# Altium schematic sheet USB2.0 Host Connectors.SchDoc: RK3399 COB Design V1.0
size A4; Author: AVIRAL MISHRA; DocumentNumber: 21; SheetNumber: 21; SheetTotal: 27; PROJECT CODE: A_V1.0
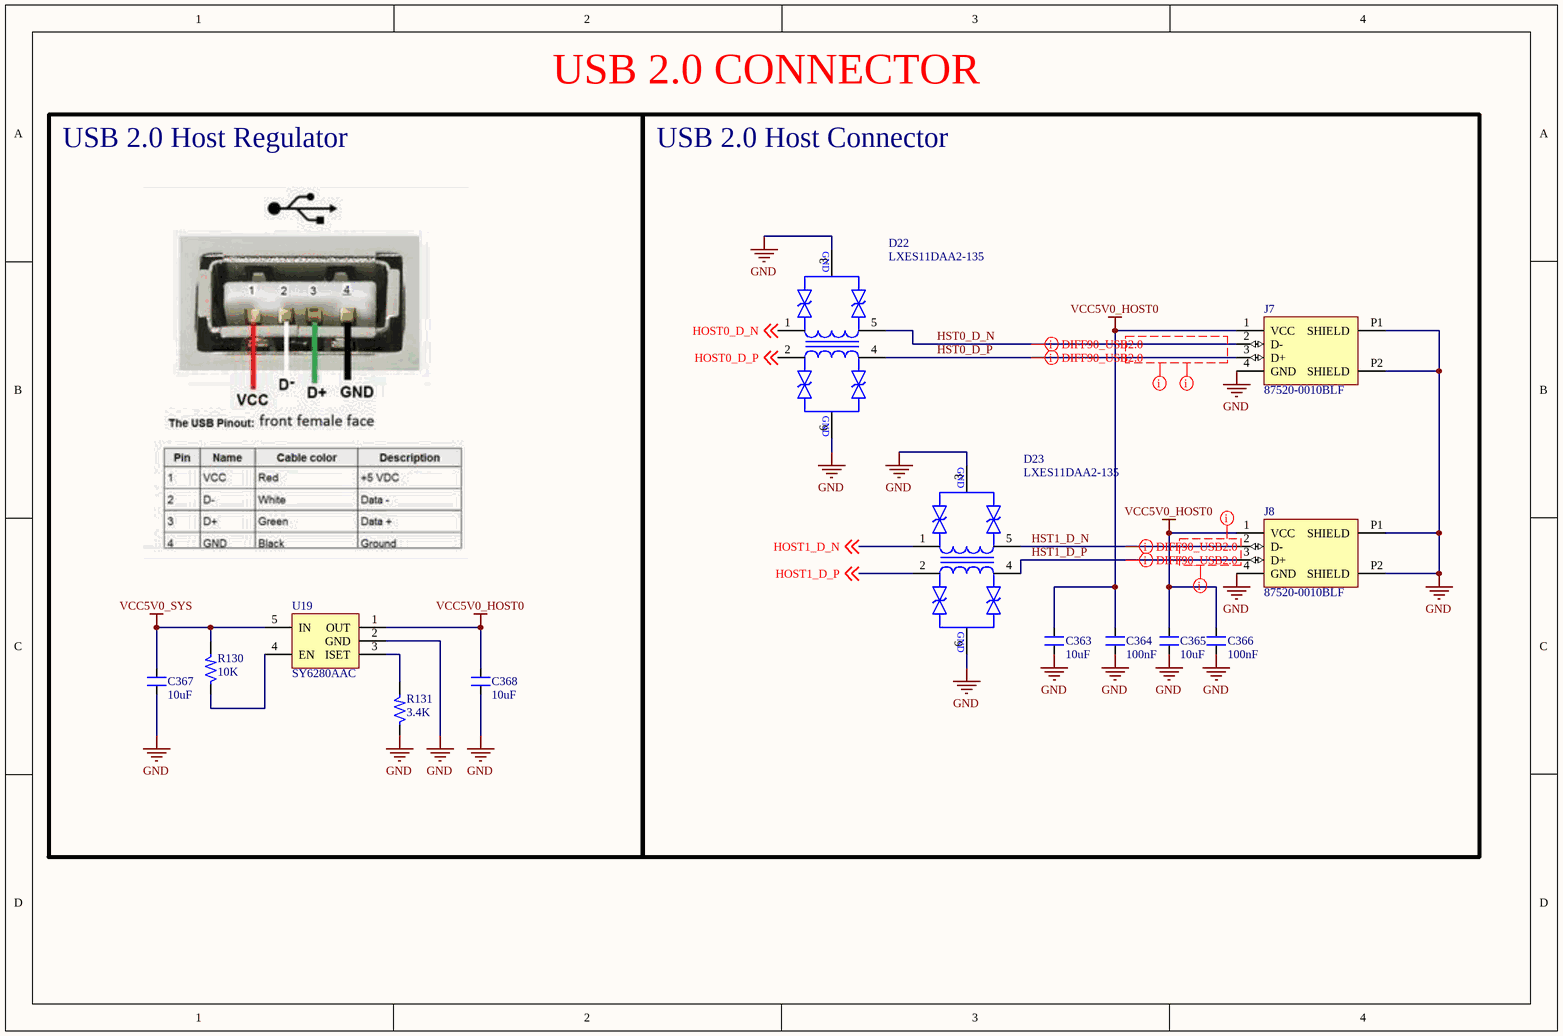
[diagram p0: USB2.0 Host Connectors.SchDoc]

## Parts
C363  10uF  [CAP_0805]
C364  100nF  [CAP_0805]
C365  10uF  [CAP_0805]
C366  100nF  [CAP_0805]
C367  10uF  [CAP_0805]
C368  10uF  [CAP_0805]
D22  LXES11DAA2-135  [DIO_LXES11D_SMD]
D23  LXES11DAA2-135  [DIO_LXES11D_SMD]
J7  87520-0010BLF  [CON4_614004134726_TH]
J8  87520-0010BLF  [CON4_614004134726_TH]
R130  10K  [RES_0603]
R131  3.4K  [RES_0603]
U19  SY6280AAC  [SOT23-5]

## Blocks framed on the sheet
USB 2.0 Host Regulator: C367 C368 R130 R131 U19
USB 2.0 Host Connector: C363-C366 D22 D23 J7 J8

## Nets
GND: C363.1 C364.1 C365.1 C366.1 C367.1 C368.1 D22.3 D22.6 D23.3 D23.6 J7.4(GND) J7.P1(SHIELD) J7.P2(SHIELD) J8.4(GND) J8.P1(SHIELD) J8.P2(SHIELD) R131.1 U19.2(GND)
VCC5V0_HOST0: C363.2 C364.2 C365.2 C366.2 C368.2 J7.1(VCC) J8.1(VCC) U19.1(OUT)
VCC5V0_SYS: C367.2 R130.2 U19.5(IN)
HOST0_D_N: D22.1 ; off-sheet HOST0_D_N
HOST0_D_P: D22.2 ; off-sheet HOST0_D_P
HOST1_D_N: D23.1 ; off-sheet HOST1_D_N
HOST1_D_P: D23.2 ; off-sheet HOST1_D_P
HST0_D_N: D22.5 J7.2(D-)
HST0_D_P: D22.4 J7.3(D+)
HST1_D_N: D23.5 J8.2(D-)
HST1_D_P: D23.4 J8.3(D+)
NetR130_1: R130.1 U19.4(EN)
NetR131_2: R131.2 U19.3(ISET)

## Layout directives
differential pair; differential pair class DIFF90_USB2.0: HST0_D_N, HST0_D_P, HST1_D_N, HST1_D_P
net class USB2.0 SIG. GROUP: (no net found under the mark)
net class DIFF_PAIR_CLASS: (no net found under the mark)

## Notes on the sheet
- USB 2.0 CONNECTOR
- TITLE:
- DOCUMENT NAME:
- SCALE 1:1
- This document is copyright of EsteemPCB and shall not be revealed, produced, copied, in whole or in part, nor
- PROJECT CODE:
- TEMPLATE:
- A4
- AUTHOR:
- Sheet
- of
- used for any purpose other than submitted.
- (in symbol DIO-T-A_5V-6SMD) GND

## Library data of the parts
C363 C365 C367 C368 = CAP_10uF-25V-10%-0805: 10µF ±10% 25V Ceramic Capacitor X5R 0805 (2012 Metric) /; Manufacturer: Murata Electronics; Manufacturer Part Number: GRM21BR61E106KA73K; Case/Package: 0805; Supplier-1: Digikey
C364 C366 = CAP_100nF-25V-10%-0805: 0.1µF ±10% 25V Ceramic Capacitor X7R 0805 (2012 Metric) /; Manufacturer: Yageo; Manufacturer Part Number: CC0805KRX7R8BB104; Case/Package: 0805; Supplier-1: Digikey
D22 D23 = DIO-T-A_5V-6SMD: Clamp Ipp Tvs Diode Surface Mount 10-SMD; Manufacturer: Murata Electronics; Manufacturer Part Number: LXES11DAA2-135; Case/Package: SMD-6; Supplier-1: Digikey
J7 J8 = CON-SKT-USB_87520-0010BLF-RA-TH: USB-A (USB TYPE-A) USB 2.0 Receptacle Connector 4 Position Through Hole, Right Angle; Manufacturer: Amphenol ICC (FCI); Manufacturer Part Number: 87520-0010BLF; Case/Package: TH; Supplier-1: Digikey
R130 = RES_10K-0.1W-1%-0603: 10 kOhms ±1% 0.1W, 1/10W Chip Resistor 0603 (1608 Metric) Thick Film /; Manufacturer: Yageo; Manufacturer Part Number: RC0603FR-0710KL; Case/Package: 0603; Supplier-1: Digikey
R131 = RES_3.4K-0.1W-1%-0603: 3.4 kOhms ±1% 0.1W, 1/10W Chip Resistor 0603 (1608 Metric) Automotive AEC-Q200 Thick Film /; Manufacturer: Stackpole Electronics Inc; Manufacturer Part Number: RMCF0603FT3K40; Case/Package: 0603; Supplier-1: Digikey
U19 = REG-ADJ_5.5V-5.5V-1.25A-SOT-23-5: SOT-23-5 PMIC - Power Distribution Switches RoHS; Manufacturer: Silergy Corp; Manufacturer Part Number: SY6280AAC; Case/Package: SOT-23-5; Supplier-1: LCSC